# Altium schematic sheet usb.SchDoc: Test
size A4; Author: Łukasz Przeniosło; Organization: PRZENIOSLO; Address1: Electronics; Address2: &; Address3: Software; DocumentNumber: 2; Revision: 1.0; SheetNumber: 2; SheetTotal: 3
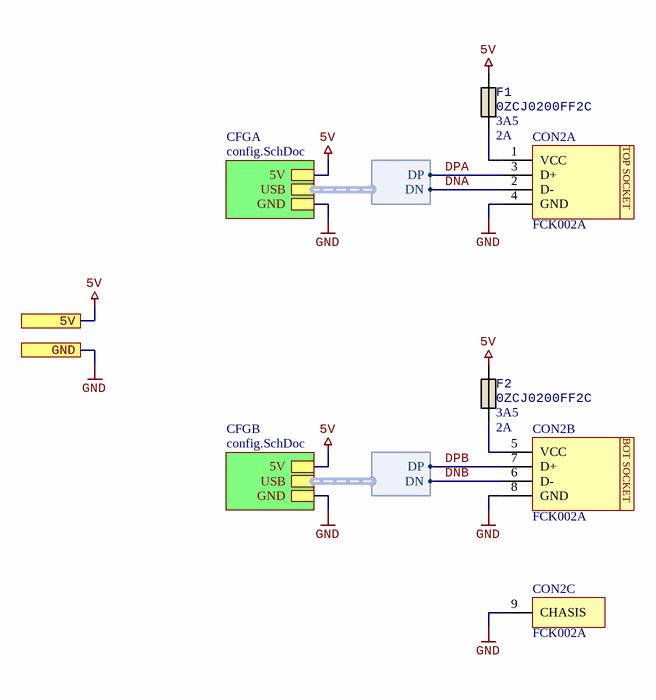
[diagram p0: usb.SchDoc]

## Parts
CON2  FCK002A  [USB-A-SOCKET-DOUBLE]  (parts A,B,C of 3)
F1  0ZCJ0200FF2C  I_trip: 3A5  I_nom: 2A  [FUSE_1206]
F2  0ZCJ0200FF2C  I_trip: 3A5  I_nom: 2A  [FUSE_1206]

## Sub-sheets
CFGA = config.SchDoc: USB (harness USB), 5V, GND
CFGB = config.SchDoc: USB (harness USB), 5V, GND

## Ports
5V, GND

## Harnesses
USB: DP, DN

## Nets
5V: F1.2 F2.2 ; port 5V, sheet CFGA/5V, sheet CFGB/5V
GND: CON2.4(GND) CON2.8(GND) CON2.9(CHASIS) ; port GND, sheet CFGA/GND, sheet CFGB/GND
DNA: CON2.2(D-) ; sheet CFGA/USB.DN
DNB: CON2.6(D-) ; sheet CFGB/USB.DN
DPA: CON2.3(D+) ; sheet CFGA/USB.DP
DPB: CON2.7(D+) ; sheet CFGB/USB.DP
NetCON2_1: CON2.1(VCC) F1.1
NetCON2_5: CON2.5(VCC) F2.1

## Notes on the sheet
- Title:
- Date:
- Author:
- Project:
- Time:
- Sheet
- of
- File:
- (in symbol USB-A-Sock-Double, part A) TOP SOCKET
- (in symbol USB-A-Sock-Double, part B) BOT SOCKET

## Library data of the parts
CON2 = USB-A-Sock-Double: Dual USB A connector; manid: FCK002A
F1 F2 = PTC: PTC SMD Fuses; manid: 0ZCJ0200FF2C